# EAGLE schematic psu (EAGLE 6.6.0)
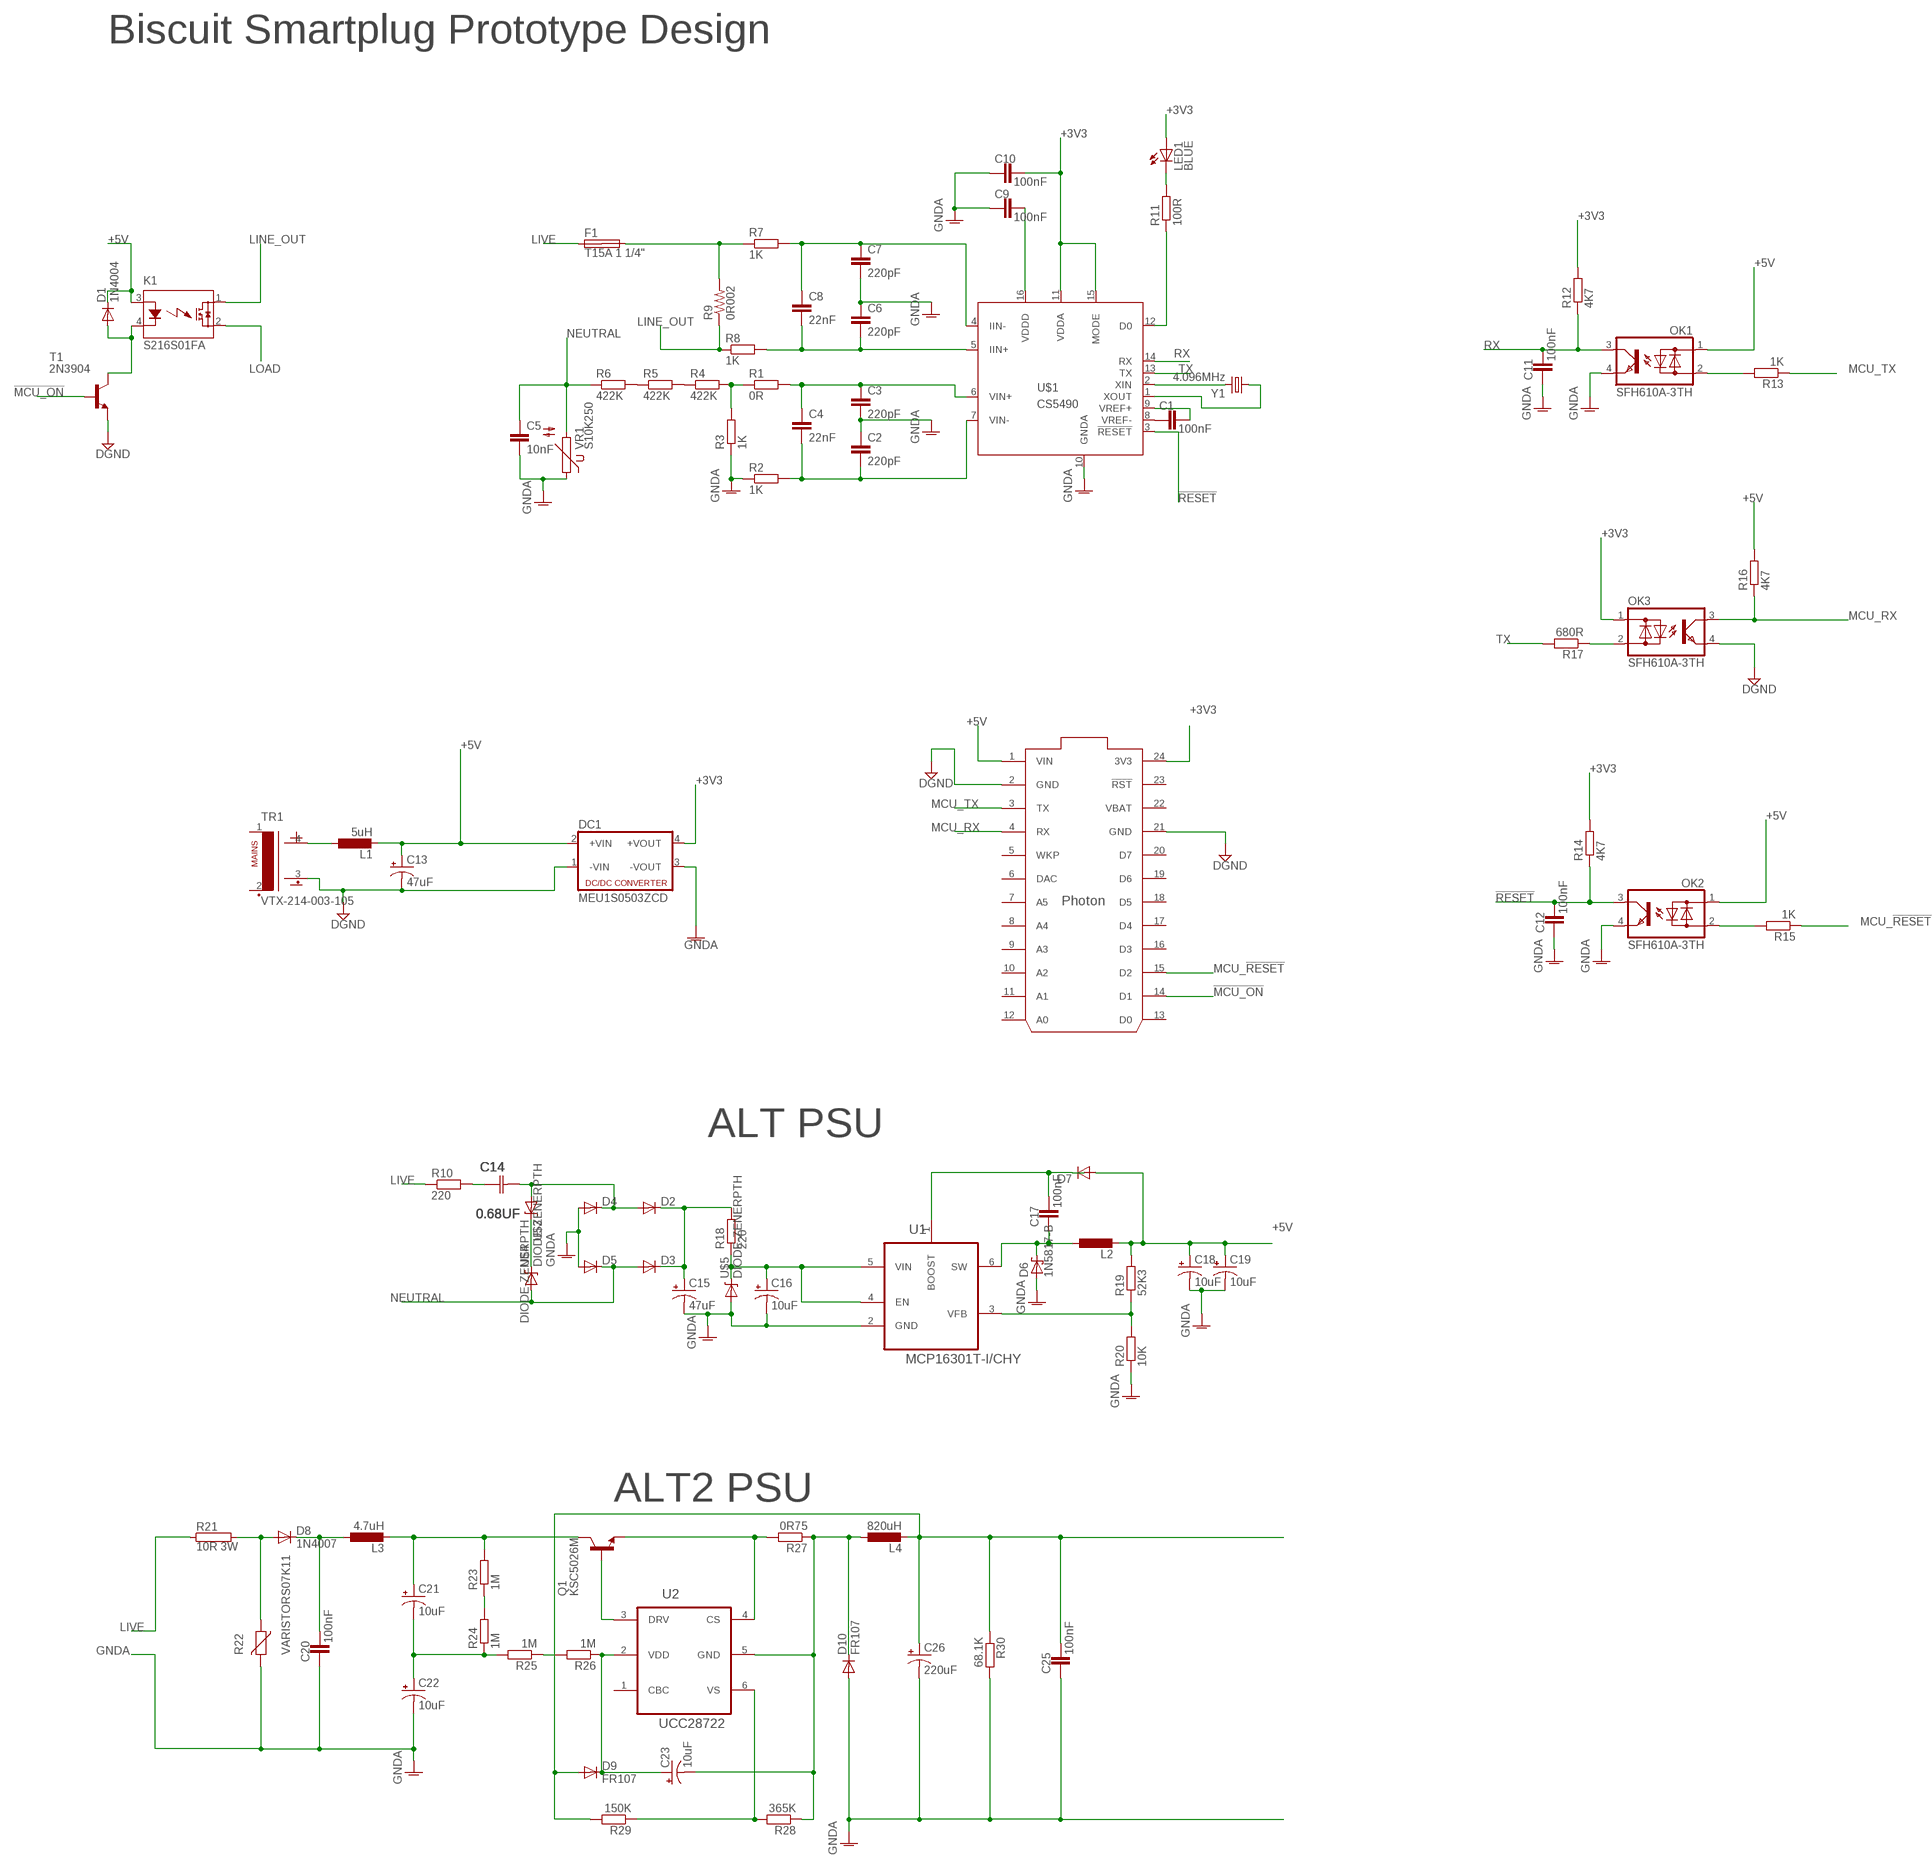
[diagram p0: schematic, sheet 1]

## Parts
C1  100nF  CAP0603-CAP  [0603-CAP]
C2  220pF  CAP0603-CAP  [0603-CAP]
C3  220pF  CAP0603-CAP  [0603-CAP]
C4  22nF  CAP0603-CAP  [0603-CAP]
C5  10nF  CAP0603-CAP  [0603-CAP]
C6  220pF  CAP0603-CAP  [0603-CAP]
C7  220pF  CAP0603-CAP  [0603-CAP]
C8  22nF  CAP0603-CAP  [0603-CAP]
C9  100nF  CAP0603-CAP  [0603-CAP]
C10  100nF  CAP0603-CAP  [0603-CAP]
C11  100nF  CAP0603-CAP  [0603-CAP]
C12  100nF  CAP0603-CAP  [0603-CAP]
C13  47uF  CAP_POLPTH1  [CPOL-RADIAL-100UF-25V]
C14  0.68UF  ECQU2A684KLA-L25.5  [CAPM2550X1050X2000]
C15  47uF  CAP_POLPTH1  [CPOL-RADIAL-100UF-25V]
C16  10uF  CAP_POLPTH1  [CPOL-RADIAL-100UF-25V]
C17  100nF  CAP0603-CAP  [0603-CAP]
C18  10uF  CAP_POLPTH1  [CPOL-RADIAL-100UF-25V]
C19  10uF  CAP_POLPTH1  [CPOL-RADIAL-100UF-25V]
C20  100nF  CAP0603-CAP  [0603-CAP]
C21  10uF  CAP_POLPTH1  [CPOL-RADIAL-100UF-25V]
C22  10uF  CAP_POLPTH1  [CPOL-RADIAL-100UF-25V]
C23  10uF  CAP_POLPTH1  [CPOL-RADIAL-100UF-25V]
C25  100nF  CAP0603-CAP  [0603-CAP]
C26  220uF  CAP_POLPTH1  [CPOL-RADIAL-100UF-25V]
D1  1N4004  [DO41-10]
D2  DIODE1N4001  [DIODE-1N4001]
D3  DIODE1N4001  [DIODE-1N4001]
D4  DIODE1N4001  [DIODE-1N4001]
D5  DIODE1N4001  [DIODE-1N4001]
D6  1N5817-B  [DO41-7.6]
D7  DIODE1N4148  [DIODE-1N4148]
D8  1N4007  DIODE1N4001  [DIODE-1N4001]
D9  FR107  DIODE1N4001  [DIODE-1N4001]
D10  FR107  DIODE1N4001  [DIODE-1N4001]
DC1  MEU1S0503ZCD  [4-PIN-ZIF]
F1  T15A 1 1/4"  SH32  [SH32]
K1  S216S01FA  [S216S01F]
L1  5uH  RLB0914-4R7MLA  [RLB0914-4R7ML]
L2  RLB0914-4R7MLA  [RLB0914-4R7ML]
L3  4.7uH  RLB0914-4R7MLA  [RLB0914-4R7ML]
L4  820uH  RLB0914-4R7MLA  [RLB0914-4R7ML]
LED1  BLUE  LED3MM  [LED3MM]
OK1  SFH610A-3TH  [DIL04]
OK2  SFH610A-3TH  [DIL04]
OK3  SFH610A-3TH  [DIL04]
Q1  KSC5026M  [TO126]
R1  0R  R-EU_0603  [0603]
R2  1K  R-EU_0603  [0603]
R3  1K  R-EU_0603  [0603]
R4  422K  R-EU_0603  [0603]
R5  422K  R-EU_0603  [0603]
R6  422K  R-EU_0603  [0603]
R7  1K  R-EU_0603  [0603]
R8  1K  R-EU_0603  [0603]
R9  0R002  RESISTOR2512  [R2512]
R10  220  R-EU_0204/7  [0204/7]
R11  100R  R-EU_0603  [0603]
R12  4K7  R-EU_0603  [0603]
R13  1K  R-EU_0603  [0603]
R14  4K7  R-EU_0603  [0603]
R15  1K  R-EU_0603  [0603]
R16  4K7  R-EU_0603  [0603]
R17  680R  R-EU_0603  [0603]
R18  220  R-EU_0204/7  [0204/7]
R19  52K3  R-EU_0204/7  [0204/7]
R20  10K  R-EU_0204/7  [0204/7]
R21  10R 3W  RAC03  [AC03]
R22  VARISTORS07K11  [S07K11]
R23  1M  R-EU_0204/7  [0204/7]
R24  1M  R-EU_0204/7  [0204/7]
R25  1M  R-EU_0204/7  [0204/7]
R26  1M  R-EU_0204/7  [0204/7]
R27  0R75  R-EU_0204/7  [0204/7]
R28  365K  R-EU_0204/7  [0204/7]
R29  150K  R-EU_0204/7  [0204/7]
R30  68.1K  R-EU_0204/7  [0204/7]
T1  2N3904  [TO92]
TR1  VTX-214-003-105  [VTX-214-003-105]
U1  MCP16301T-I/CHY  [SOT95P290X145-6N]
U2  UCC28722  [SOT95P290X145-6N]
U$1  CS5490  [SOIC16N]
U$2  PHOTON_WITH_HEADERS  [PHOTON]
U$3  DIODE-ZENERPTH  [DIODE-ZENER]
U$4  DIODE-ZENERPTH  [DIODE-ZENER]
U$5  DIODE-ZENERPTH  [DIODE-ZENER]
VR1  S10K250  [S10K250]
Y1  4.096MHz  CRYSTAL10.5X4.8  [CRYSTAL-SMD-10.5X4.8-2PIN]

## Nets
!MCU_ON: T1.2(B) U$2.14(D1)
!RESET: C12.2 OK2.3(C) R14.1 U$1.3(!RESET)
+3V3: C10.2 DC1.4(+VOUT) LED1.A OK3.1(AC1) R12.2 R14.2 U$1.11(VDDA) U$1.15(MODE) U$2.24(3V3)
+5V: C13.1(+) C18.1(+) C19.1(+) D1.C D7.A DC1.2(+VIN) K1.3(A) L1.2 L2.2 OK1.1(AC1) OK2.1(AC1) R16.2 R19.2 U$2.1(VIN)
DGND: C13.2(-) DC1.1(-VIN) OK3.4(E) T1.3(E) TR1.3(-VE) U$2.2(GND) U$2.21(GND)
GNDA: C2.1 C3.2 C5.2 C6.1 C7.2 C9.1 C10.1 C11.1 C12.1 C15.2(-) C16.2(-) C18.2(-) C19.2(-) C20.1 C22.2(-) C25.1 C26.2(-) D4.A D5.A D6.A D10.A DC1.3(-VOUT) OK1.4(E) OK2.4(E) R2.1 R3.1 R20.1 R22.2 R30.2 U1.2(GND) U$1.10(GNDA) U$5.P$2(A) VR1.1
LINE_OUT: K1.1(DS1) R8.1 R9.1
LIVE: F1.1A F1.2A R7.1 R9.2 R10.1 R21.1
LOAD: K1.2(DS2)
MCU_!RESET: R15.1 U$2.15(D2)
MCU_RX: OK3.3(C) R16.1 U$2.4(RX)
MCU_TX: R13.1 U$2.3(TX)
N$1: U$1.2(XIN) Y1.P$2
N$2: U$1.1(XOUT) Y1.P$1
N$3: C1.1 U$1.8(VREF-)
N$4: C1.2 U$1.9(VREF+)
N$5: C9.2 U$1.16(VDDD)
N$6: C14.1 R10.2
N$7: C2.2 C4.2 R2.2 U$1.7(VIN-)
N$8: C3.1 C4.1 R1.2 U$1.6(VIN+)
N$9: C6.2 C8.2 R8.2 U$1.5(IIN+)
N$10: C7.1 C8.1 R7.2 U$1.4(IIN-)
N$11: R1.1 R3.2 R4.2
N$12: OK1.2(AC2) R13.2
N$13: R4.1 R5.2
N$14: R5.1 R6.2
N$15: C14.2 D2.A D4.C U$3.P$2(A)
N$16: R11.1 U$1.12(D0)
N$17: D1.A K1.4(K) T1.1(C)
N$18: U$3.P$1(C) U$4.P$1(C)
N$19: LED1.K(C) R11.2
N$20: OK2.2(AC2) R15.2
N$21: L1.1 TR1.4(+VE)
N$22: OK3.2(AC2) R17.1
N$23: D8.A R21.2 R22.1
N$24: C17.2 D7.C U1.1(BOOST)
N$25: C20.2 D8.C L3.1
N$26: R19.1 R20.2 U1.3(VFB)
N$27: C15.1(+) D2.C D3.C R18.2
N$28: C21.2(-) C22.1(+) R24.1 R25.2
N$29: C16.1(+) R18.1 U1.4(EN) U1.5(VIN) U$5.P$1(C)
N$30: C17.1 D6.C L2.1 U1.6(SW)
N$31: C21.1(+) L3.2 Q1.2(C) R23.2
N$32: R23.1 R24.2
N$33: R25.1 R26.2
N$34: C23.1(+) D9.C R26.1 U2.2(VDD)
N$35: Q1.3(B) U2.3(DRV)
N$36: Q1.1(E) R27.2 U2.4(CS)
N$38: C23.2(-) D10.C L4.1 R27.1 R28.1 U2.5(GND)
N$39: R28.2 R29.1 U2.6(VS)
N$41: C25.2 C26.1(+) D9.A L4.2 R29.2 R30.1
NEUTRAL: C5.1 D3.A D5.C R6.1 U$4.P$2(A) VR1.2
RX: C11.2 OK1.3(C) R12.1 U$1.14(RX)
TX: R17.2 U$1.13(TX)
Unconnected: F1.1B F1.2B TR1.1(L) TR1.2(N) U2.1(CBC) U$2.5(WKP) U$2.6(DAC) U$2.7(A5) U$2.8(A4) U$2.9(A3) U$2.10(A2) U$2.11(A1) U$2.12(A0) U$2.13(D0) U$2.16(D3) U$2.17(D4) U$2.18(D5) U$2.19(D6) U$2.20(D7) U$2.23(!RST)

## Notes on the sheet
- Biscuit Smartplug Prototype Design
- ALT PSU
- ALT2 PSU

## Power pins joined to a net without a drawn wire
VBAT: U$2.22(VBAT)

## Library data of the parts
C1-C12 C17 C20 C25 = SparkFun:CAP: Capacitor Standard 0603 ceramic capacitor, and 0.1" leaded capacitor.
C13 C15 C16 C18 C19 C21-C23 = SparkFun:CAP_POL: Capacitor Polarized These are standard SMD and PTH capacitors. Normally 10uF, 47uF, and 100uF in electrolytic and tantalum varieties. Always verify the external diameter of the through hole cap, it varies with capacity, voltage, and manufacturer. The EIA devices should be standard.
C14 = smartplug:ECQ: Stacked Metallized Plastic Film Capacitor; MPN: ECQU2A684KLA; OC_FARNELL: 1673316; OC_NEWARK: 39P9861; RATEDVOLTAGE: 275V; SUPPLIER: PANASONIC; TOLERANCE: ±10%
C26 = smartplug:CAP_POL: Capacitor Polarized These are standard SMD and PTH capacitors. Normally 10uF, 47uF, and 100uF in electrolytic and tantalum varieties. Always verify the external diameter of the through hole cap, it varies with capacity, voltage, and manufacturer. The EIA devices should be standard.
D1 = adafruit:1N4004: DIODE General purpose 1N400x type rectifier (With bigger pads) http://www.ladyada.net/library/pcb/eaglelibrary.html
D2-D5 D7-D10 = Rebel:DIODE: Diode These are standard reverse protection diodes and small signal diodes. SMA package can handle up to about 1A. SOD-323 can handle about 200mA. Watch the SOD-323 package when ordering, there are some mfgs out there that are 5-pin packages.
D6 = diode:1N581*: 1.0A SCHOTTKY BARRIER RECTIFIER Source: http://www.diodes.com/datasheets/ds23001.pdf
DC1 = smartplug:MEU1S0503ZC
F1 = smartplug:SH32: FUSE HOLDER 6 x 32 mm, SH contact, SHH3N Schukat, 102071 Wickmann (Buerklin); MPN: 10207101009; OC_FARNELL: 811786; OC_NEWARK: 76R6904
K1 = smartplug:S216S01F: SSR
L1-L4 = smartplug:RLB0914-4R7ML
LED1 = Rebel:LED: LED
OK1-OK3 = smartplug:SFH610A-3; MPN: SFH610A-3; OC_FARNELL: 1469569
Q1 = smartplug:KSC5026M: NPN Transistor
R1-R8 R10-R20 R23-R30 = Rebel:R-EU_: RESISTOR, European symbol
R9 = SparkFun:RESISTOR: Resistor Basic schematic elements and footprints for 0603, 1206, and PTH resistors.
R21 = resistor-power:R: Power Resitor; OC_FARNELL: unknown; OC_NEWARK: unknown
R22 = varistor:VARISTOR: VARISTOR
T1 = smartplug:2N3904: NPN TRANSISTOR
TR1 = smartplug:VTX-214-003-105
U1 = smartplug:MCP16301T-I/CHY: IC, BUCK, ADJ, 0.6A, 6SOT23; MPN: MCP16301T-I/CHY; OC_FARNELL: 2009288; OC_NEWARK: 58T3650; PACKAGE: SOT23-6; SUPPLIER: Microchip
U2 = smartplug:UCC28722: Constant-Voltage, Constant-Current Controller With Primary-Side Regulation, BJT Drive; MPN: UCC28722; OC_FARNELL: 2400944; PACKAGE: SOT23-6; SUPPLIER: Ti
U$1 = smartplug:CS5490
U$2 = smartplug:PHOTON
U$3-U$5 = SparkFun:DIODE-ZENER: Zener Diode Production Part - 8199 3.4V Zener Voltage
VR1 = varistor:S10K250: VARISTOR
Y1 = SparkFun:CRYSTAL: Crystals Various standard crystals. Proven footprints. Spark Fun Electronics SKU : COM-00534